# Altium schematic sheet Main.SchDoc
size A; SheetNumber: 1; SheetTotal: 3
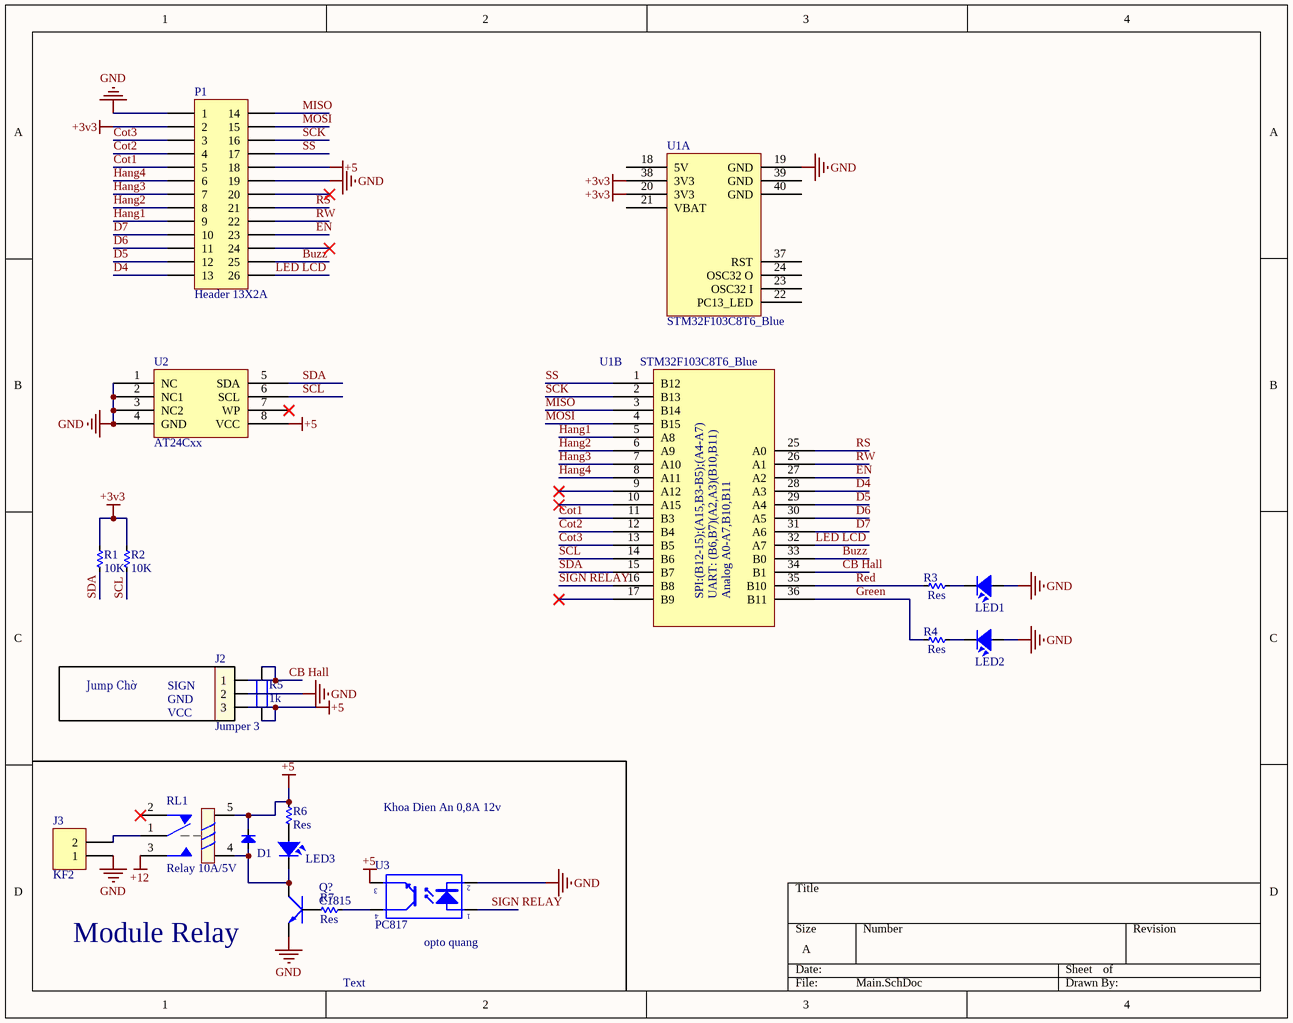
[diagram p0: Main.SchDoc]

## Parts
D1  Diode  [DIO-0.5A-SMALL]  (value not drawn)
J2  Jumper 3  [JP3]
J3  KF2  [KF2-3.5]
LED1  LED  [LED-3MM-BLUE]  (value not drawn)
LED2  LED  [LED-3MM-BLUE]  (value not drawn)
LED3  LED  [LED-3MM-YELLOW]  (value not drawn)
P1  Header 13X2A  [HDR2X13_CEN]
Q?  C1815  [QTO-92]
R1  10K  [RES-SMD-0805]
R2  10K  [RES-SMD-0805]
R3  Res  [RES-SMD-0805]
R4  Res  [RES-SMD-0805]
R5  1k  [R1/4W]
R6  Res  [RES-SMD-0805]
R7  Res  [RES-SMD-0805]
RL1  Relay 10A/5V  [RL_SPDT_10A]
U1  STM32F103C8T6_Blue  [STM32F103 Blue Pill]  (parts A,B of 2)
U2  AT24Cxx  [SOP8smd]
U3  PC817  [DIP4/W0.3]

## Nets
+3v3: P1.2 R1.2 R2.2 U1.20(3V3) U1.38(3V3)
+5: D1.2(K) J2.3 P1.18 R5.1 R6.1 RL1.5 U2.8(VCC) U3.3(E)
+12: RL1.3
GND: J2.2 J3.1 LED1.1 LED2.1 P1.1 P1.19 Q?.1(E) U1.19(GND) U2.1(NC) U2.2(NC1) U2.3(NC2) U2.4(GND) U3.2(K)
Buzz: P1.25 U1.33(B0)
CB Hall: J2.1 R5.2 U1.34(B1)
Cot1: P1.5 U1.11(B3)
Cot2: P1.4 U1.12(B4)
Cot3: P1.3 U1.13(B5)
D4: P1.13 U1.28(A3)
D5: P1.12 U1.29(A4)
D6: P1.11 U1.30(A5)
D7: P1.10 U1.31(A6)
EN: P1.23 U1.27(A2)
Green: R4.2 U1.36(B11)
Hang1: P1.9 U1.5(A8)
Hang2: P1.8 U1.6(A9)
Hang3: P1.7 U1.7(A10)
Hang4: P1.6 U1.8(A11)
LED LCD: P1.26 U1.32(A7)
MISO: P1.14 U1.3(B14)
MOSI: P1.15 U1.4(B15)
Red: R3.2 U1.35(B10)
RS: P1.21 U1.25(A0)
RW: P1.22 U1.26(A1)
SCK: P1.16 U1.2(B13)
SCL: R2.1 U1.14(B6) U2.6(SCL)
SDA: R1.1 U1.15(B7) U2.5(SDA)
SIGN RELAY: U1.16(B8) U3.1(A)
SS: P1.17 U1.1(B12)
NetD1_1: D1.1(A) LED3.2 Q?.2(C) RL1.4
NetJ3_2: J3.2 RL1.1
NetLED1_2: LED1.2 R3.1
NetLED2_2: LED2.2 R4.1
NetLED3_1: LED3.1 R6.2
NetQ?_3: Q?.3(B) R7.2
NetR7_1: R7.1 U3.4(C)

Not connected (* = marked no-connect by the designer): P1 20* 24*; RL1 2*; U1 9(A12)* 10(A15)* 17(B9)* 18(5V) 21(VBAT) 22(PC13_LED) 23(OSC32_I) 24(OSC32_O) 37(RST) 39(GND) 40(GND); U2 7(WP)*

## Notes on the sheet
- Jump Chờ
- GND
- (near J2) SIGN
- VCC
- Khoa Dien An 0,8A 12v
- Module Relay
- (near U3) opto quang
- Text
- (in symbol STM32F103C8T6_Blue, part B) SPI:(B12-15);(A15,B3-B5);(A4-A7); UART: (B6,B7)(A2,A3)(B10,B11); Analog A0-A7,B10,B11

## Library data of the parts
D1 = Diode: Default Diode; Code - JEDEC: DO-214-AB; Value: 1N5007; Published: 8-Jun-2000; Revision: July-2002: Re-released for DXP Platform.; Publisher: Altium Limited
J2 = JP3: Value: J3
J3 = KF2: Manufacturer: Würth Elektronik eiSos GmbH; partNo: 691103110002; ComponentLink1 Description: Manufacturer; ComponentLink2 Description: Datasheet; NoPins: 2; Created Date: 29 October 2013; ComponentLink1URL: http://www.we-online.com; ComponentLink2URL: http://katalog.we-online.de/em/datasheet/6911031100xx.pdf; Created by: Karrer Zheng
LED1-LED3 = LED: LED Single colour Green and Red; Value: LED 3 ly Single Colour
P1 = Header 13X2A: Header, 13-Pin, Dual row; Solder: WAVE
Q? = C1815: NPN 600mW, ECB; Value: C1815
R1-R4 R6 R7 = Res-SMD: Resistor; Manufacturer: Generic Components; Class: Passive; Published: 08/06/2000; Publisher: Altium Hobart Technology Centre
R5 = R1/4W: Resistor 1/4W; Value: R1/4W - 1K
RL1 = Relay 1: Relay SPDT,10A - 12VDC 5 Pin; Value: Relay SPDT, 10A, 12V
U1 = STM32F103C8T6_Blue: Kit STM32F103C8T6 Blue Pill
U3 = PC817: Single Opto; Value: PC817